# Altium schematic sheet PreampDraftSCH.SchDoc
size A
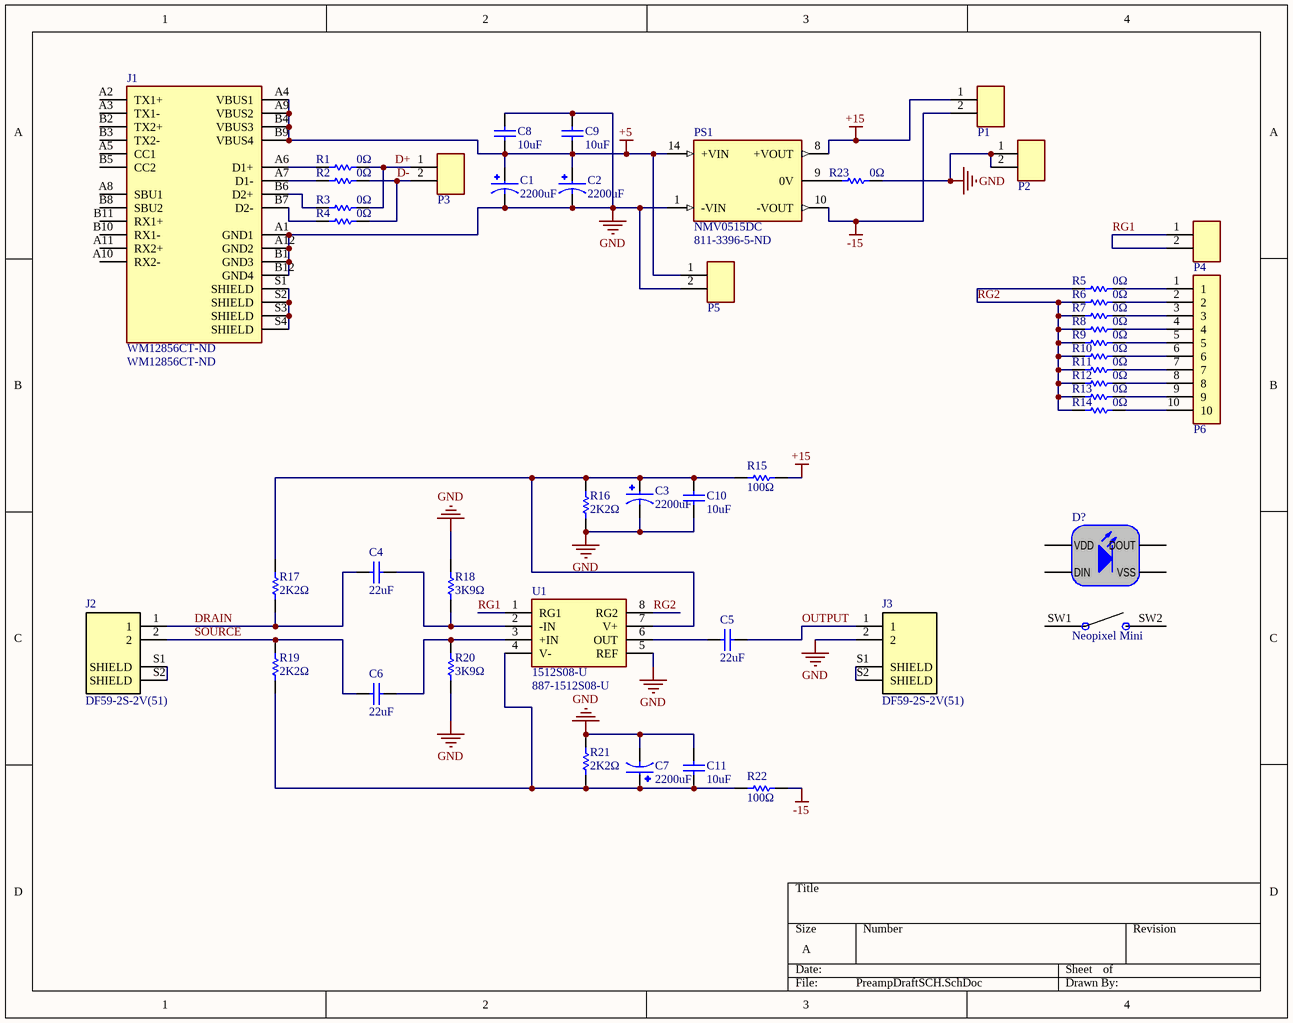
[diagram p0: PreampDraftSCH.SchDoc]

## Parts
C1  2200uF  [CAP-RADIAL-12.5MM]
C2  2200uF  [CAP-RADIAL-12.5MM]
C3  2200uF  [CAP-RADIAL-12.5MM]
C4  22uF  [0805-CAP]
C5  22uF  [0805-CAP]
C6  22uF  [0805-CAP]
C7  2200uF  [CAP-RADIAL-12.5MM]
C8  10uF  [1210-CAP]
C9  10uF  [1210-CAP]
C10  10uF  [1210-CAP]
C11  10uF  [1210-CAP]
D?  Neopixel Mini  [SiliconKeypadUnit]
J1  WM12856CT-ND  [USBC_MOLEX]
J2  DF59-2S-2V(51)  [SNAPBEE_DF59-2S-2V]
J3  DF59-2S-2V(51)  [SNAPBEE_DF59-2S-2V]
P1  HEADER_1x2  [PIN2]  (value not drawn)
P2  HEADER_1x2  [PIN2]  (value not drawn)
P3  HEADER_1x2  [PIN2]  (value not drawn)
P4  HEADER_1x2  [PIN2]  (value not drawn)
P5  HEADER_1x2  [PIN2]  (value not drawn)
P6  HEADER_1x10  [PIN10]  (value not drawn)
PS1  NMV0515DC  Supplier Part Number 1: 811-3396-5-ND  [CONV_NMV0515DC]
R1  0Ω  [0603_RES]
R2  0Ω  [0603_RES]
R3  0Ω  [0603_RES]
R4  0Ω  [0603_RES]
R5  0Ω  [0603_RES]
R6  0Ω  [0603_RES]
R7  0Ω  [0603_RES]
R8  0Ω  [0603_RES]
R9  0Ω  [0603_RES]
R10  0Ω  [0603_RES]
R11  0Ω  [0603_RES]
R12  0Ω  [0603_RES]
R13  0Ω  [0603_RES]
R14  0Ω  [0603_RES]
R15  100Ω  [0603_RES]
R16  2K2Ω  [0603_RES]
R17  2K2Ω  [0603_RES]
R18  3K9Ω  [0603_RES]
R19  2K2Ω  [0603_RES]
R20  3K9Ω  [0603_RES]
R21  2K2Ω  [0603_RES]
R22  100Ω  [0603_RES]
R23  0Ω  [0603_RES]
U1  1512S08-U  Supplier Part Number 1: 887-1512S08-U  [SOIC-8_N]

## Nets
+5: C1.P C2.P C8.1 C9.1 J1.A4(VBUS1) J1.A9(VBUS2) J1.B4(VBUS3) J1.B9(VBUS4) P5.1(+) PS1.14(+VIN)
+15: P1.1(+) PS1.8(+VOUT) R15.2
-15: P1.2(-) PS1.10(-VOUT) R22.2
GND: C1.N C2.N C3.N C7.N C8.2 C9.2 C10.1 C11.2 J1.A1(GND1) J1.A12(GND2) J1.B1(GND3) J1.B12(GND4) J3.2 P2.1(+) P2.2(-) P5.2(-) PS1.1(-VIN) R16.1 R18.2 R20.1 R21.2 R23.2 U1.5(REF)
D+: P3.1(+) R1.2 R3.2
D-: P3.2(-) R2.2 R4.2
DRAIN: C4.1 J2.1 R17.1
OUTPUT: C5.2 J3.1
RG1: P4.1(+) P4.2(-) U1.1(RG1)
RG2: R5.1 R6.1 R7.1 R8.1 R9.1 R10.1 R11.1 R12.1 R13.1 R14.1 U1.8(RG2)
SOURCE: C6.1 J2.2 R19.2
NetC3_P: C3.P C10.2 R15.1 R16.2 R17.2 U1.7(V+)
NetC4_2: C4.2 R18.1 U1.2(-IN)
NetC5_1: C5.1 U1.6(OUT)
NetC6_2: C6.2 R20.2 U1.3(+IN)
NetC7_P: C7.P C11.1 R19.1 R21.1 R22.1 U1.4(V-)
NetJ1_A6: J1.A6(D1+) R1.1
NetJ1_A7: J1.A7(D1-) R2.1
NetJ1_B6: J1.B6(D2+) R3.1
NetJ1_B7: J1.B7(D2-) R4.1
NetJ1_S1: J1.S1(SHIELD) J1.S2(SHIELD) J1.S3(SHIELD) J1.S4(SHIELD)
NetJ2_S1: J2.S1(SHIELD) J2.S2(SHIELD)
NetJ3_S1: J3.S1(SHIELD) J3.S2(SHIELD)
NetP6_1: P6.1 R5.2
NetP6_2: P6.2 R6.2
NetP6_3: P6.3 R7.2
NetP6_4: P6.4 R8.2
NetP6_5: P6.5 R9.2
NetP6_6: P6.6 R10.2
NetP6_7: P6.7 R11.2
NetP6_8: P6.8 R12.2
NetP6_9: P6.9 R13.2
NetP6_10: P6.10 R14.2
NetPS1_9: PS1.9(0V) R23.1

Not connected (* = marked no-connect by the designer): D? 1(DOUT) 2(VSS) 3(DIN) 4(VDD) SW1 SW2; J1 A2(TX1+) A3(TX1-) A5(CC1) A8(SBU1) A10(RX2-) A11(RX2+) B2(TX2+) B3(TX2-) B5(CC2) B8(SBU2) B10(RX1-) B11(RX1+)

## Library data of the parts
C1-C3 C7 = UFW1C222MHD: CAP ALUM 2200UF 20% 16V RADIAL; MP: EEUHD1V681B; MF: Panasonic; Package: RADIAL-2 Panasonic; Availability: In Stock; Value: *; Purchase-URL: https://pricing.snapeda.com/search/part/EEUHD1V681B/?ref=eda; Check_prices: https://www.snapeda.com/parts/EEUHD1V681B/Panasonic/view-part/5784870/?ref=eda; Price: None; SnapEDA_Link: https://www.snapeda.com/parts/EEUHD1V681B/Panasonic/view-part/5784870/?ref=snap; Supplier 1: Digi-Key; Supplier Part Number 1: 493-15122-ND
C4-C6 = CAP_22U_0805: CAP CER 22UF 16V X5R 0805; Published: 8-Jun-2000; LatestRevisionDate: 17-Jul-2002; LatestRevisionNote: Re-released for DXP Platform.; Publisher: Altium Limited; PackageDescription: Radial Cap, Thru-Hole; 2 Leads; 0.3 in Pin Spacing; PackageReference: RAD-0.3; Supplier 1: Digi-Key; Supplier Part Number 1: 1276-6526-1-ND
C8-C11 = CAP_10U_1210: CAP CER 10UF 25V X7R 1210; Published: 8-Jun-2000; LatestRevisionDate: 17-Jul-2002; LatestRevisionNote: Re-released for DXP Platform.; Publisher: Altium Limited; PackageDescription: Radial Cap, Thru-Hole; 2 Leads; 0.3 in Pin Spacing; PackageReference: RAD-0.3; Supplier 1: Digi-Key; Supplier Part Number 1: 445-8792-1-ND
D? = SK6812MINI-B-BUTTON: ADDRESS LED DISC SERIAL RGB; Supplier 1: Digi-Key; Supplier Part Number 1: 1528-1541-ND
J1 = USB-C: CONN RCP USB3.1 TYPEC 24P SMD RA; MF: Molex; MP: 1054500101; Package: None; Digi-Key_Part_Number: WM12856CT-ND; SnapEDA_Link: https://www.snapeda.com/parts/1054500101/Molex/view-part/448528/?ref=snap; Digi-Key_Purchase_URL: https://www.digikey.tw/product-detail/en/molex/1054500101/WM12856CT-ND/5843891?utm_source=snapeda&utm_medium=aggregator&utm_campaign=symbol; Value: *; Supplier 1: Digi-Key; Supplier Part Number 1: WM12856CT-ND
J2 J3 = SNAPBEE_DF59-2S-2V: CONN SSL RCPT 2POS 2MM SOLDER; Supplier 1: Digi-Key; Supplier 2: Digi-Key; Supplier 3: Digi-Key; Supplier Part Number 1: H11961CT-ND; Supplier Part Number 2: H11958-ND; Supplier Part Number 3: H11957CT-ND
PS1 = NMV0515DC: Isolated 1W Dual Output DC-DC Converter 3kVDC, 4.5-9V Input; Package: None; Price: None; Value: *; MP: NMV0515DC; Availability: Unavailable; Supplier 1: Digi-Key
R1-R14 R23 = RES_0R_0603: RES SMD 0 OHM JUMPER 1/10W 0603; Published: 8-Jun-2000; LatestRevisionDate: 17-Jul-2002; LatestRevisionNote: Re-released for DXP Platform.; PackageReference: AXIAL-0.3; Publisher: Altium Limited; PackageDescription: Axial Device, Thru-Hole; 2 Leads; 0.3 in Pin Spacing; Supplier 1: Digi-Key; Supplier Part Number 1: 311-0.0GRDKR-ND
R15 R22 = RES_100R_0603: RES SMD 100 OHM 1% 1/10W 0603; Published: 8-Jun-2000; LatestRevisionDate: 17-Jul-2002; LatestRevisionNote: Re-released for DXP Platform.; PackageReference: AXIAL-0.3; Publisher: Altium Limited; PackageDescription: Axial Device, Thru-Hole; 2 Leads; 0.3 in Pin Spacing; Supplier 1: Digi-Key; Supplier Part Number 1: 311-100HRCT-ND
R16 R17 R19 R21 = RES_2K2_0603: RES SMD 2.2K OHM 1% 1/10W 0603; Published: 8-Jun-2000; LatestRevisionDate: 17-Jul-2002; LatestRevisionNote: Re-released for DXP Platform.; PackageReference: AXIAL-0.3; Publisher: Altium Limited; PackageDescription: Axial Device, Thru-Hole; 2 Leads; 0.3 in Pin Spacing; Supplier 1: Digi-Key; Supplier Part Number 1: 311-2.20KHRCT-ND
R18 R20 = RES_3K9_0603: RES SMD 3.9KOHM 0.05% 1/10W 0603; Published: 8-Jun-2000; LatestRevisionDate: 17-Jul-2002; LatestRevisionNote: Re-released for DXP Platform.; PackageReference: AXIAL-0.3; Publisher: Altium Limited; PackageDescription: Axial Device, Thru-Hole; 2 Leads; 0.3 in Pin Spacing; Supplier 1: Digi-Key; Supplier Part Number 1: P3.9KBECT-ND
U1 = 1512S08-U: IC MIC PREAMP HIGH PERFORM. AUDIO 0dB SOIC-8; Manufacturer 1: NXP Semiconductors; Manufacturer Part Number 1: TJA1040T/CM,118; Min Supply Voltage: 4.75V; Max Supply Voltage: 5.25V; Number of Transceivers: 1; Operating Supply Voltage: 5V; Nominal Supply Current: 70mA; Interface: Serial; Data Rate: 1Mbps; Simplex/Duplex: Half Duplex; Receiver Hysteresis: 70mV; Stock 1: 18495; Pricing 1: 1=1.43000, 10=1.28200, 100=0.99950, 500=0.82566, 1000=0.65184 (USD); RoHS: Yes; Mount: Surface Mount; Case/Package: SO; Number of Pins: 8; Contact Plating: Gold; Min Operating Temperature: -40°C; Max Operating Temperature: 150°C; Packaging: Tape and Reel; Package Quantity: 1; Max Supply Current: 70mA; Number of Transmit Buffers: 1; Number of Receive Buffers: 1; Radiation Hardening: No; Lead Free: Lead Free; REACH SVHC: No SVHC; ComponentLink1URL: https://datasheet.ciiva.com/26933/getdatasheetpartid-728716-26933443.pdf?src-supplier=Verical; ComponentLink1Description: https://datasheet.ciiva.com/26933/getdatasheetpartid-728716-26933443.pdf?src-supplier=Verical; ComponentLink2URL: https://datasheet.ciiva.com/16514/tja1040-16514421.pdf?src-supplier=Future+Electronics; ComponentLink2Description: https://datasheet.ciiva.com/16514/tja1040-16514421.pdf?src-supplier=Future+Electronics; ComponentLink3URL: https://datasheet.ciiva.com/18624/tja1040-18624870.pdf?src-supplier=Digi-Key; ComponentLink3Description: https://datasheet.ciiva.com/18624/tja1040-18624870.pdf?src-supplier=Digi-Key; ComponentLink4URL: https://datasheet.ciiva.com/18624/tja1040-18624871.pdf?src-supplier=Digi-Key; ComponentLink4Description: https://datasheet.ciiva.com/18624/tja1040-18624871.pdf?src-supplier=Digi-Key; Supplier 1: Mouser